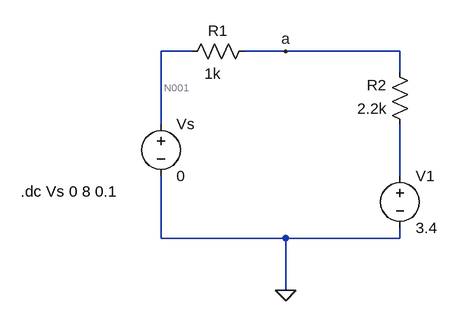
[diagram p0: schematic circuit2.asc]
circuit2.asc, the LTspice schematic file:
Version 4
SHEET 1 880 680
WIRE 16 -352 -32 -352
WIRE 160 -352 96 -352
WIRE 336 -352 160 -352
WIRE 336 -320 336 -352
WIRE -32 -240 -32 -352
WIRE 336 -160 336 -240
WIRE -32 -64 -32 -160
WIRE 160 -64 -32 -64
WIRE 336 -64 336 -80
WIRE 336 -64 160 -64
WIRE 160 16 160 -64
FLAG 160 16 0
FLAG 160 -352 a
SYMBOL voltage -32 -256 R0
WINDOW 123 0 0 Left 0
WINDOW 39 0 0 Left 0
SYMATTR InstName Vs
SYMATTR Value 0
SYMBOL voltage 336 -176 R0
WINDOW 123 0 0 Left 0
WINDOW 39 0 0 Left 0
SYMATTR InstName V1
SYMATTR Value 3.4
SYMBOL res 352 -224 R180
WINDOW 0 36 76 Left 2
WINDOW 3 36 40 Left 2
SYMATTR InstName R2
SYMATTR Value 2.2k
SYMBOL res 0 -336 R270
WINDOW 0 32 56 VTop 2
WINDOW 3 -3 48 VBottom 2
SYMATTR InstName R1
SYMATTR Value 1k
TEXT -248 -136 Left 2 !.dc Vs 0 8 0.1

The netlist it stands for:
* circuit2.asc
Vs N001 0 0
V1 N002 0 3.4
R2 N002 a 2.2k
R1 N001 a 1k
.dc Vs 0 8 0.1
.backanno
.end

* Results of the author's LTspice run, read from the files saved beside the schematic
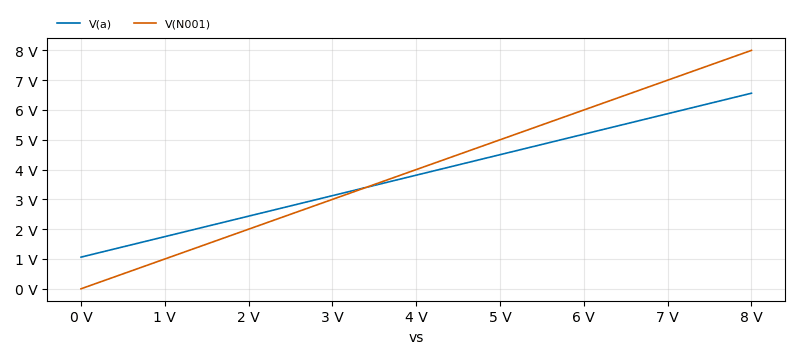
[diagram p1: DC transfer characteristic of circuit2.asc, plotted from the saved traces]
* DC transfer characteristic, 1 run:
*   V(a): 1.062 V at vs=0 V, 6.562 V at vs=8 V, min 1.062 V, max 6.562 V
*   V(N001): 0 V at vs=0 V, 8 V at vs=8 V, min 0 V, max 8 V